# EAGLE design Select Fire Rapidstrike (EAGLE 9.4.2)

## Sheet 1 of 4
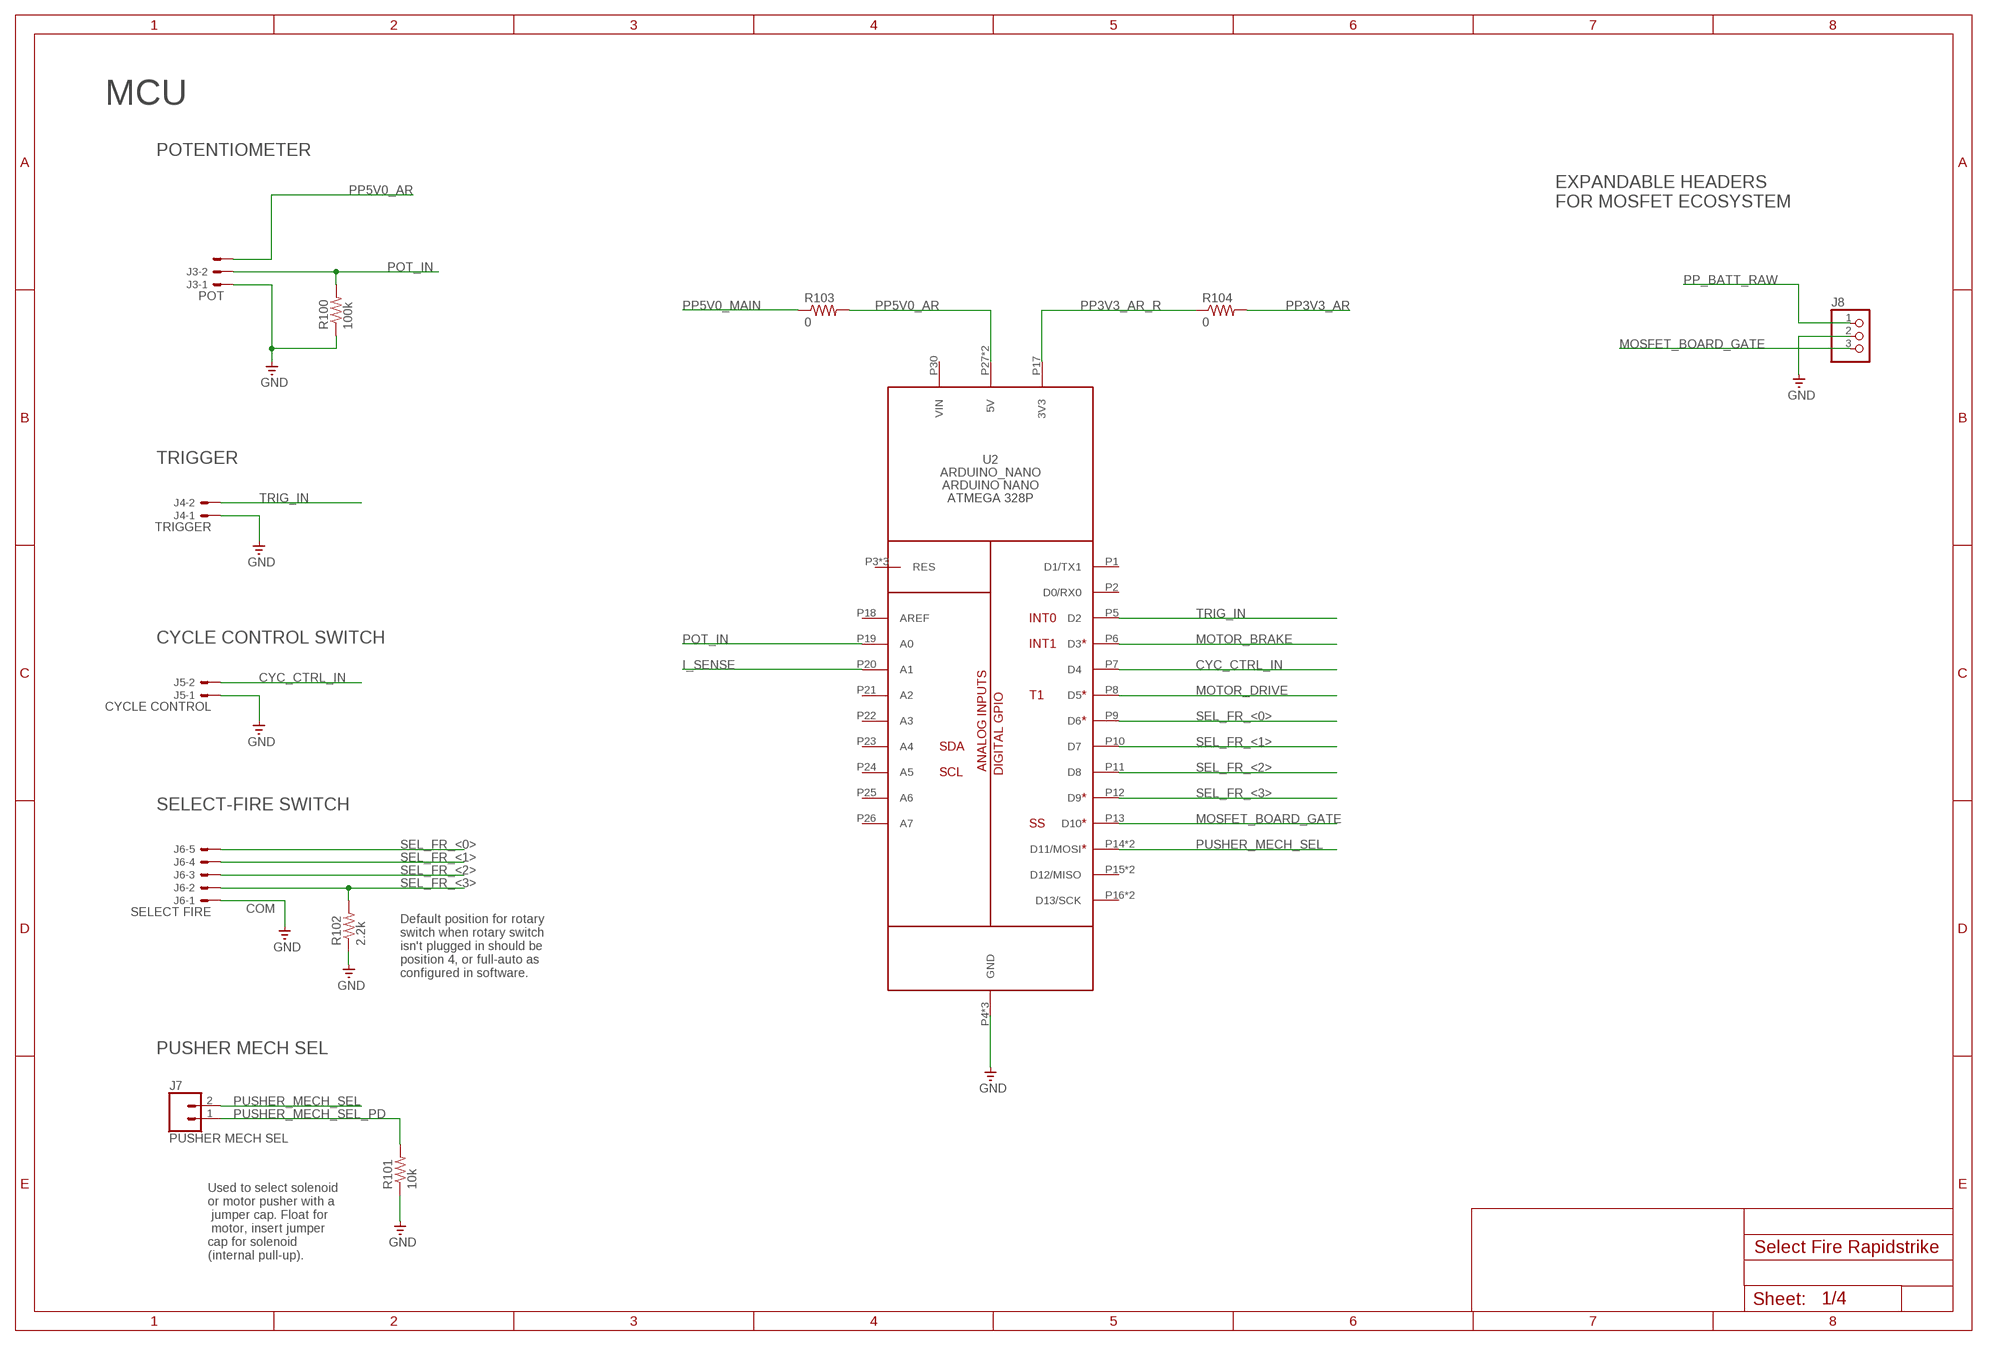
[diagram p0: schematic, sheet 1]

### Parts
J3  POT  JST-XH-03-PIN-LONG-PAD  [JST-XH-03-PACKAGE-LONG-PAD]
J4  TRIGGER  JST-XH-02-PIN-LONG-PAD  [JST-XH-02-PACKAGE-LONG-PAD]
J5  CYCLE CONTROL  JST-XH-02-PIN-LONG-PAD  [JST-XH-02-PACKAGE-LONG-PAD]
J6  SELECT FIRE  JST-XH-05-PIN-LONG-PAD  [JST-XH-05-PACKAGE-LONG-PAD]
J7  PUSHER MECH SEL  CONN_02  [1X02]
J8  PINHD-1X3  [1X03]
R100  100k  R-US_M0805  [M0805]
R101  10k  R-US_M0805  [M0805]
R102  2.2k  R-US_M0805  [M0805]
R103  0  R-US_M0805  [M0805]
R104  0  R-US_M0805  [M0805]
U2  ARDUINO_NANO  [ARDUINO_NANO]

### Nets
CYC_CTRL_IN: J5.2 U2.P7(D4)
GND: J3.1 J4.1 J5.1 J6.1 J8.2 R100.1 R101.1 R102.1 U2.P4(GND) U2.P29(GND) U2.P32(GND) ; also sheet 2,3,4
I_SENSE: U2.P20(A1) ; also sheet 3
MOSFET_BOARD_GATE: J8.3 U2.P13(D10)
MOTOR_BRAKE: U2.P6(D3) ; also sheet 3
MOTOR_DRIVE: U2.P8(D5) ; also sheet 3,4
POT_IN: J3.2 R100.2 U2.P19(A0)
PP3V3_AR: R104.2 ; also sheet 2
PP3V3_AR_R: R104.1 U2.P17(3V3)
PP5V0_AR: J3.3 R103.2 U2.P27(5V) U2.P36(5V) ; also sheet 2,3,4
PP5V0_MAIN: R103.1 ; also sheet 2
PP_BATT_RAW: J8.1 ; also sheet 2,3
PUSHER_MECH_SEL: J7.2 U2.P14(D11/MOSI) U2.P34(D11/MOSI)
PUSHER_MECH_SEL_PD: J7.1 R101.2
SEL_FR_<0>: J6.5 U2.P9(D6)
SEL_FR_<1>: J6.4 U2.P10(D7)
SEL_FR_<2>: J6.3 U2.P11(D8)
SEL_FR_<3>: J6.2 R102.2 U2.P12(D9)
TRIG_IN: J4.2 U2.P5(D2)
Unconnected: U2.P1(D1/TX1) U2.P2(D0/RX0) U2.P3(RES) U2.P15(D12/MISO) U2.P16(D13/SCK) U2.P18(AREF) U2.P21(A2) U2.P22(A3) U2.P23(A4) U2.P24(A5) U2.P25(A6) U2.P26(A7) U2.P28(RES) U2.P30(VIN) U2.P31(RES) U2.P33(D13/SCK) U2.P35(D12/MISO)

### Notes on the sheet
- MCU
- POTENTIOMETER
- EXPANDABLE HEADERS 
  FOR MOSFET ECOSYSTEM
- TRIGGER
- CYCLE CONTROL SWITCH
- SELECT-FIRE SWITCH
- COM
- Default position for rotary
  switch when rotary switch 
  isn't plugged in should be 
  position 4, or full-auto as 
  configured in software.
- PUSHER MECH SEL
- Used to select solenoid 
  or motor pusher with a
   jumper cap. Float for
   motor, insert jumper 
  cap for solenoid 
  (internal pull-up).

## Sheet 2 of 4
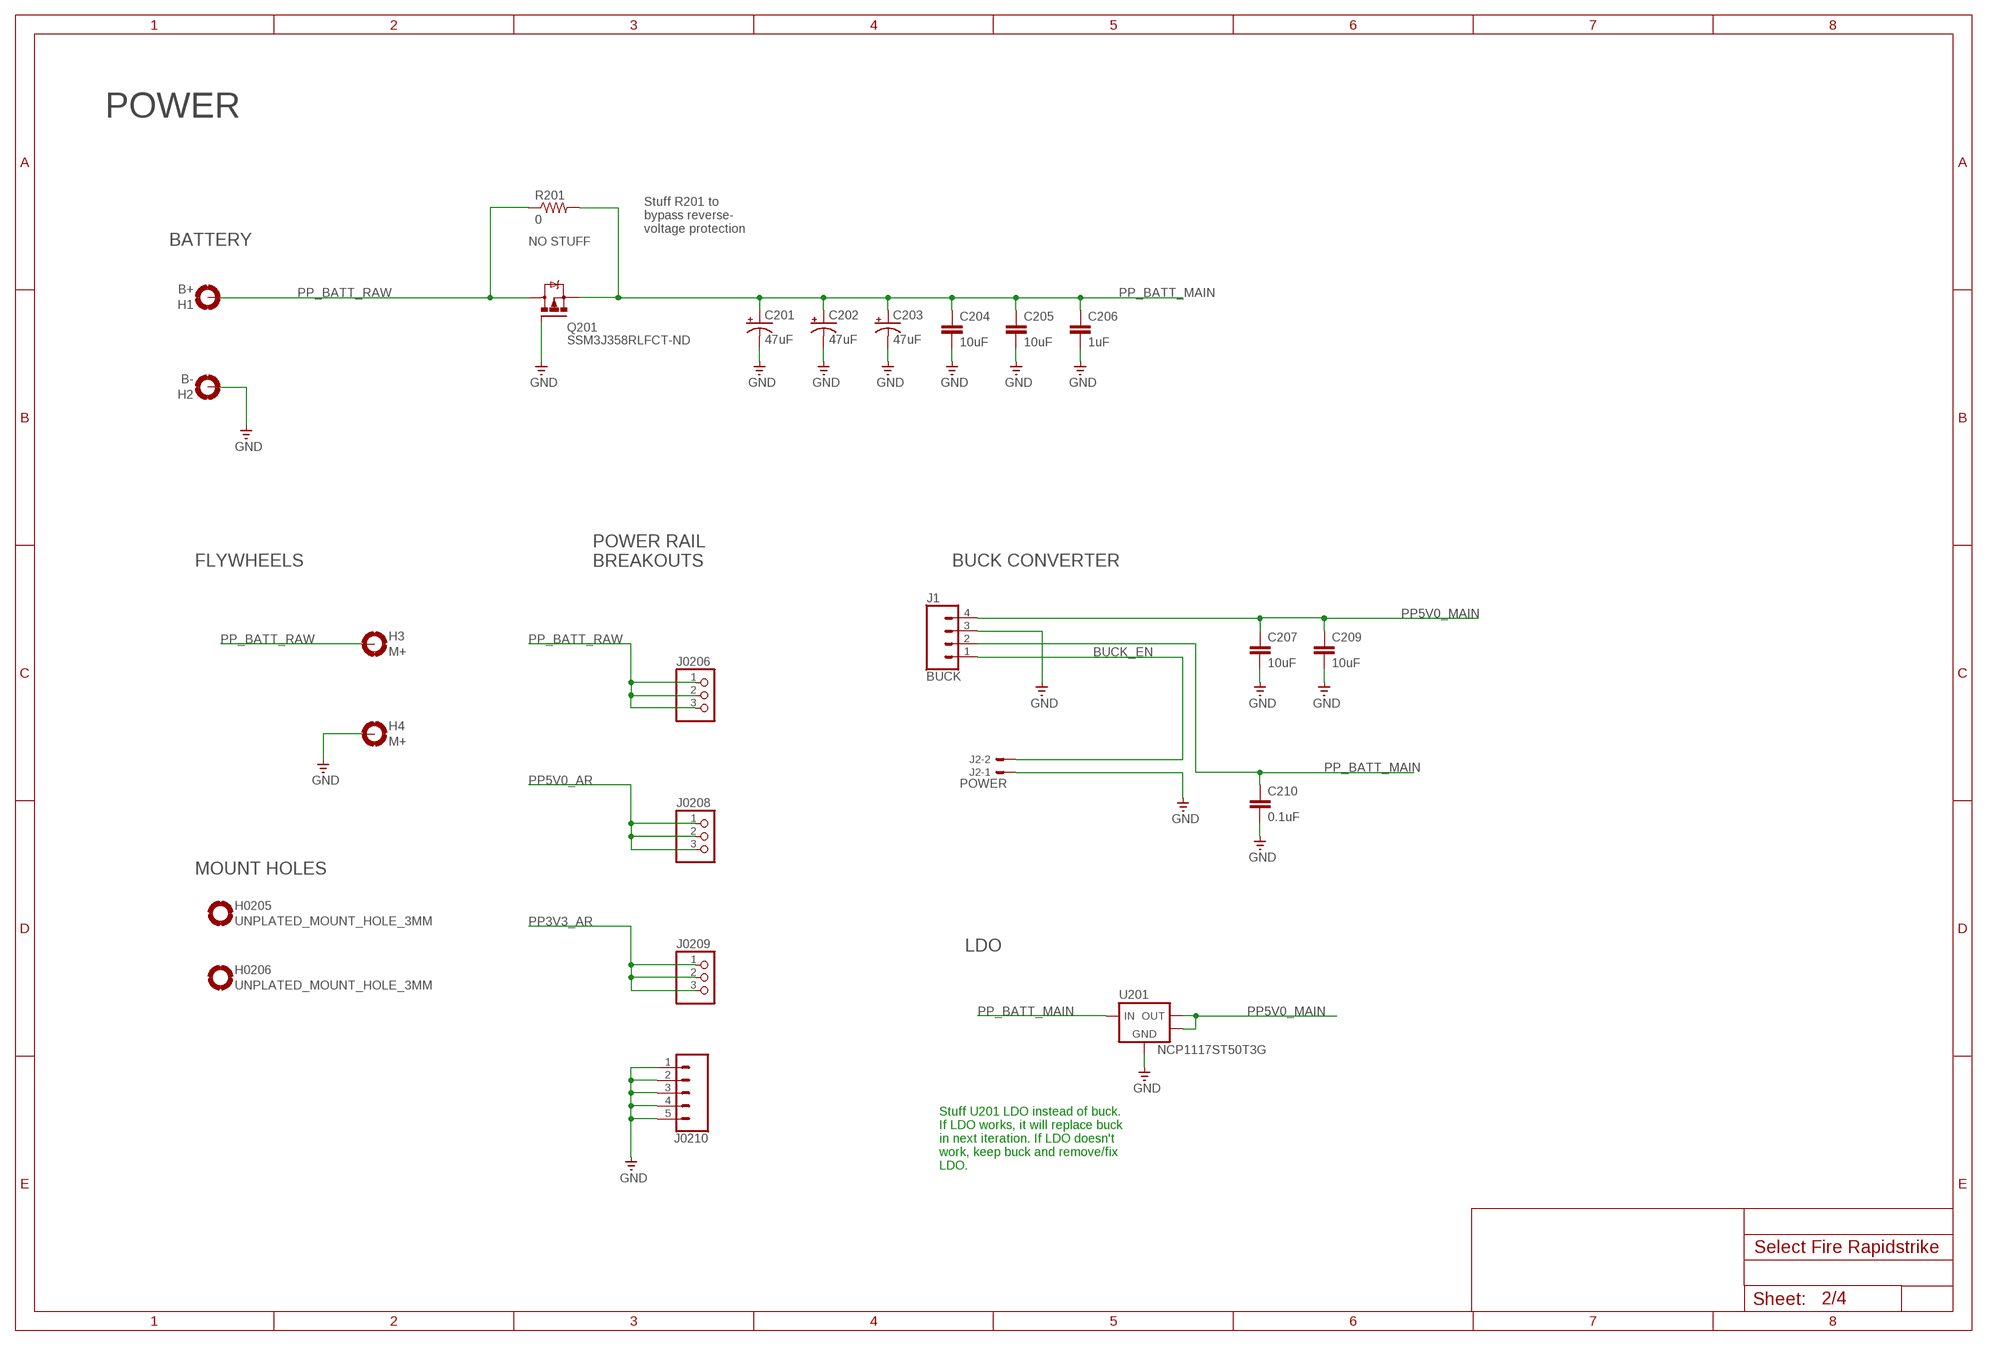
[diagram p1: schematic, sheet 2]

### Parts
C201  47uF  CPOL-USE2-5  [E2-5]
C202  47uF  CPOL-USE2-5  [E2-5]
C203  47uF  CPOL-USE2-5  [E2-5]
C204  10uF  CC1206  [C1206]
C205  10uF  CC1206  [C1206]
C206  1uF  C-EUC0805  [C0805]
C207  10uF  CC1206  [C1206]
C209  10uF  CC1206  [C1206]
C210  0.1uF  C-EUC0805  [C0805]
H1  B+  MOUNT-HOLE-2.5MM  [MOUNT-HOLE-2.5MM]
H2  B-  MOUNT-HOLE-2.5MM  [MOUNT-HOLE-2.5MM]
H3  M+  MOUNT-HOLE-2.5MM  [MOUNT-HOLE-2.5MM]
H4  M+  MOUNT-HOLE-2.5MM  [MOUNT-HOLE-2.5MM]
H0205  UNPLATED_MOUNT_HOLE_3MM  [UNPLATED_MOUNT_HOLE_3MM]
H0206  UNPLATED_MOUNT_HOLE_3MM  [UNPLATED_MOUNT_HOLE_3MM]
J1  BUCK  CONN_04  [1X04]
J2  POWER  JST-XH-02-PIN-LONG-PAD  [JST-XH-02-PACKAGE-LONG-PAD]
J0206  PINHD-1X3  [1X03]
J0208  PINHD-1X3  [1X03]
J0209  PINHD-1X3  [1X03]
J0210  CONN_05  [1X05]
Q201  SSM3J358RLFCT-ND  MOSFET-P-SOT23  [SOT-23]
R201  0  R-US_M0805  [M0805]
U201  NCP1117ST50T3G  LM1117-SOT223  [SOT-223-3]

### Nets
BUCK_EN: J1.1 J2.2
GND: C201.- C202.- C203.- C204.2 C205.2 C206.2 C207.2 C209.2 C210.2 H2.P$1(MOUNT) H4.P$1(MOUNT) J1.3 J2.1 J0210.1 J0210.2 J0210.3 J0210.4 J0210.5 Q201.1(G) U201.1(GND) ; also sheet 1,3,4
PP3V3_AR: J0209.1 J0209.2 J0209.3 ; also sheet 1
PP5V0_AR: J0208.1 J0208.2 J0208.3 ; also sheet 1,3,4
PP5V0_MAIN: C207.1 C209.1 J1.4 U201.2(VOUT) U201.4(HEATSINK) ; also sheet 1
PP_BATT_MAIN [BATT_POWER]: C201.+ C202.+ C203.+ C204.1 C205.1 C206.1 C210.1 J1.2 Q201.2(S) R201.2 U201.3(VIN)
PP_BATT_RAW: H1.P$1(MOUNT) H3.P$1(MOUNT) J0206.1 J0206.2 J0206.3 Q201.3(D) R201.1 ; also sheet 1,3

### Notes on the sheet
- POWER
- Stuff R201 to 
  bypass reverse-
  voltage protection
- BATTERY
- FLYWHEELS
- POWER RAIL
  BREAKOUTS
- BUCK CONVERTER
- MOUNT HOLES
- LDO
- Stuff U201 LDO instead of buck. 
  If LDO works, it will replace buck
  in next iteration. If LDO doesn't 
  work, keep buck and remove/fix
  LDO.

## Sheet 3 of 4
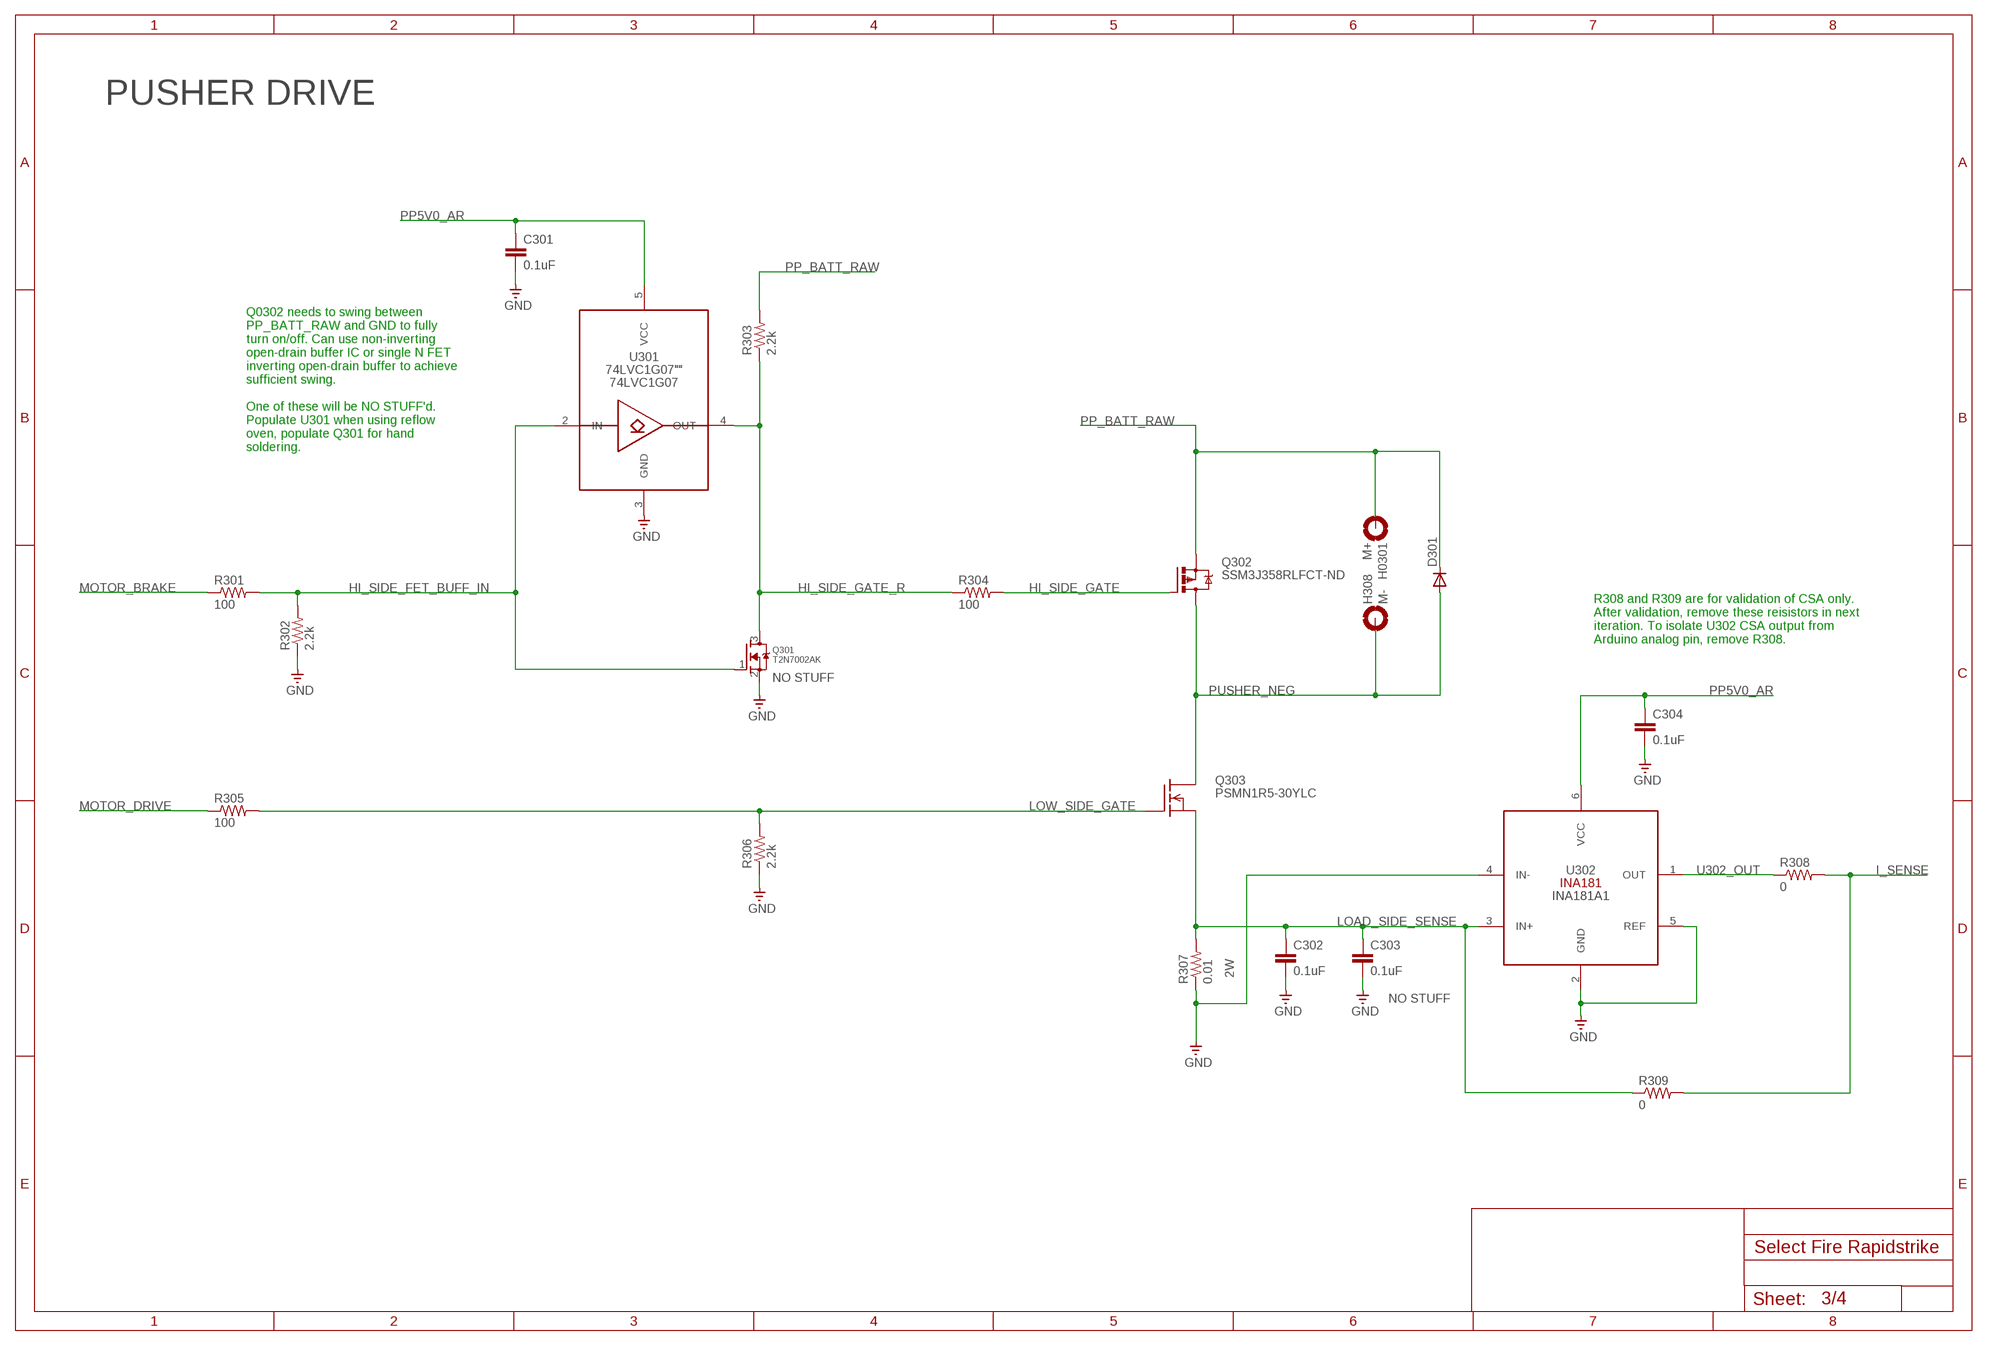
[diagram p2: schematic, sheet 3]

### Parts
C301  0.1uF  C-EUC0805  [C0805]
C302  0.1uF  C-EUC0805  [C0805]
C303  0.1uF  C-EUC0805  [C0805]
C304  0.1uF  C-EUC0805  [C0805]
D301  S2A  [DO214AA]
H0301  M+  MOUNT-HOLE-2.5MM  [MOUNT-HOLE-2.5MM]
H308  M-  MOUNT-HOLE-2.5MM  [MOUNT-HOLE-2.5MM]
Q301  T2N7002AK  MOSFET-NREFLOW  [SOT23]
Q302  SSM3J358RLFCT-ND  MOSFET-P-SOT23  [SOT-23]
Q303  PSMN1R5-30YLC  [TO127P600X120-5N]
R301  100  R-US_M0805  [M0805]
R302  2.2k  R-US_M0805  [M0805]
R303  2.2k  R-US_M0805  [M0805]
R304  100  R-US_M0805  [M0805]
R305  100  R-US_M0805  [M0805]
R306  2.2k  R-US_M0805  [M0805]
R307  0.01  R-US_R2512  [R2512]
R308  0  R-US_M0805  [M0805]
R309  0  R-US_M0805  [M0805]
U301  74LVC1G07""  [SOT353]
U302  INA181A1  INA181  [SOT23-6]

### Nets
GND: C301.2 C302.2 C303.2 C304.2 Q301.2(S) R302.1 R306.1 R307.1 U301.3(GND) U302.2(GND) U302.4(IN-) U302.5(REF) ; also sheet 1,2,4
HI_SIDE_FET_BUFF_IN: Q301.1(G) R301.2 R302.2 U301.2(IN)
HI_SIDE_GATE: Q302.1(G) R304.2 ; also sheet 4
HI_SIDE_GATE_R: Q301.3(D) R303.1 R304.1 U301.4(OUT)
I_SENSE: R308.2 R309.2 ; also sheet 1
LOAD_SIDE_SENSE: C302.1 C303.1 Q303.1(S) Q303.2(S) Q303.3(S) R307.2 R309.1 U302.3(IN+)
LOW_SIDE_GATE: Q303.4(G) R305.2 R306.2
MOTOR_BRAKE: R301.1 ; also sheet 1
MOTOR_DRIVE: R305.1 ; also sheet 1,4
PP5V0_AR: C301.1 C304.1 U301.5(VCC) U302.6(VCC) ; also sheet 1,2,4
PP_BATT_RAW: D301.C H0301.P$1(MOUNT) Q302.2(S) R303.2 ; also sheet 1,2
PUSHER_NEG: D301.A H308.P$1(MOUNT) Q302.3(D) Q303.5(D)
U302_OUT [BATT_POWER]: R308.1 U302.1(OUT)

### Notes on the sheet
- PUSHER DRIVE
- Q0302 needs to swing between 
  PP_BATT_RAW and GND to fully
  turn on/off. Can use non-inverting
  open-drain buffer IC or single N FET
  inverting open-drain buffer to achieve
  sufficient swing. 
  
  One of these will be NO STUFF'd. 
  Populate U301 when using reflow 
  oven, populate Q301 for hand 
  soldering.
- R308 and R309 are for validation of CSA only.
  After validation, remove these reisistors in next
  iteration. To isolate U302 CSA output from 
  Arduino analog pin, remove R308.

## Sheet 4 of 4
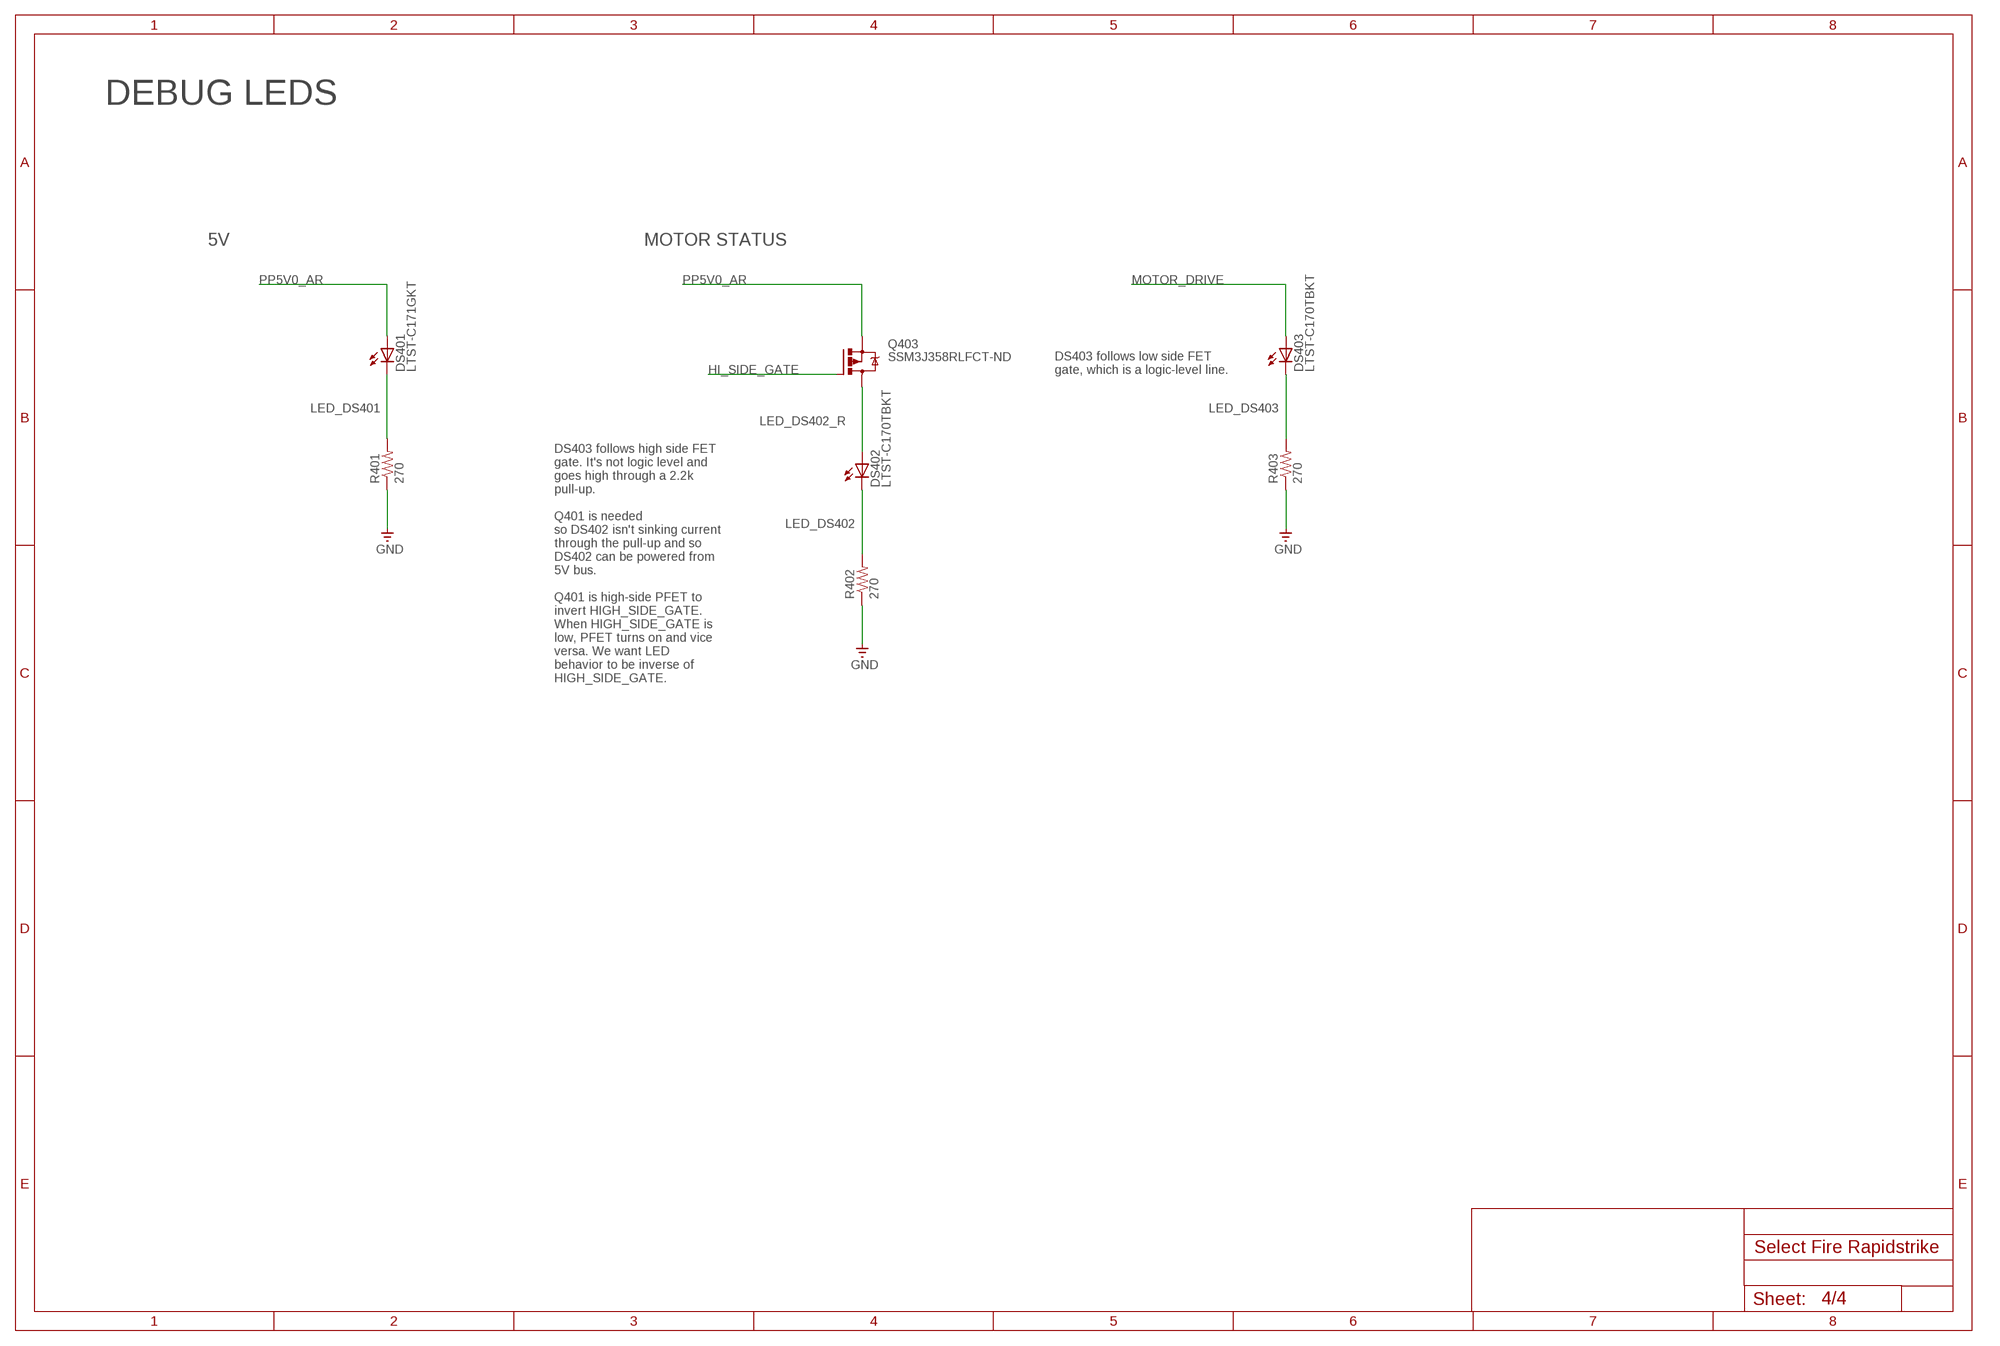
[diagram p3: schematic, sheet 4]

### Parts
DS401  LTST-C171GKT  LEDCHIPLED_0805  [CHIPLED_0805]
DS402  LTST-C170TBKT  LEDCHIPLED_0805  [CHIPLED_0805]
DS403  LTST-C170TBKT  LEDCHIPLED_0805  [CHIPLED_0805]
Q403  SSM3J358RLFCT-ND  MOSFET-P-SOT23  [SOT-23]
R401  270  R-US_M0805  [M0805]
R402  270  R-US_M0805  [M0805]
R403  270  R-US_M0805  [M0805]

### Nets
GND: R401.1 R402.1 R403.1 ; also sheet 1,2,3
HI_SIDE_GATE: Q403.1(G) ; also sheet 3
LED_DS401 [BATT_POWER]: DS401.C R401.2
LED_DS402 [BATT_POWER]: DS402.C R402.2
LED_DS402_R [BATT_POWER]: DS402.A Q403.3(D)
LED_DS403 [BATT_POWER]: DS403.C R403.2
MOTOR_DRIVE: DS403.A ; also sheet 1,3
PP5V0_AR: DS401.A Q403.2(S) ; also sheet 1,2,3

### Notes on the sheet
- DEBUG LEDS
- 5V | MOTOR STATUS
- DS403 follows low side FET 
  gate, which is a logic-level line.
- DS403 follows high side FET
  gate. It's not logic level and 
  goes high through a 2.2k 
  pull-up. 
  
  Q401 is needed 
  so DS402 isn't sinking current
  through the pull-up and so
  DS402 can be powered from 
  5V bus. 
  
  Q401 is high-side PFET to 
  invert HIGH_SIDE_GATE. 
  When HIGH_SIDE_GATE is 
  low, PFET turns on and vice
  versa. We want LED 
  behavior to be inverse of 
  HIGH_SIDE_GATE.

## Library data of the parts
C201-C203 = adafruit:CPOL-US: POLARIZED CAPACITOR, American symbol
C204 C205 C207 C209 = eagle-ltspice:C: CAPACITOR, European symbol; SPICEMODEL: NONE; SPICEPREFIX: C
C206 C210 C301 C302 C304 = rcl:C-EU: CAPACITOR, European symbol; SPICEPREFIX: C
C303 = rcl:C-EU: CAPACITOR, European symbol; SPICEPREFIX: C; STUFF: NO STUFF
D301 = s2x_10:S2*: S2A - S2M General Purpose Rectifiers Source: http://www.fairchildsemi.com/datasheets/S2/S2A.pdf; MF: Fairchild; MPN: S2A; OC_FARNELL: 1467485; OC_NEWARK: 58K2391
DS401-DS403 = adafruit:LED: LED OSRAM: - CHIPLED LG R971, LG N971, LY N971, LG Q971, LY Q971, LO R971, LY R971 LH N974, LH R974 LS Q976, LO Q976, LY Q976 LO Q996 - Hyper CHIPLED LW Q18S LB Q993, LB Q99A, LB R99A - SideLED LS A670, LO A670, LY A670, LG A670, LP A670 LB A673, LV A673, LT A673, LW A673 LH A674 LY A675 LS A676, LA A676, LO A676, LY A676, LW A676 LS A679, LY A679, LG A679 - Hyper Micro SIDELED® LS Y876, LA Y876, LO Y876, LY Y876 LT Y87S - SmartLED LW L88C, LW L88S LB L89C, LB L89S, LG L890 LS L89K, LO L89K, LY L89K LS L896, LA L896, LO L896, LY L896 - TOPLED LS T670, LO T670, LY T670, LG T670, LP T670 LSG T670, LSP T670, LSY T670, LOP T670, LYG T670 LG T671, LOG T671, LSG T671 LB T673, LV T673, LT T673, LW T673 LH T674 LS T676, LA T676, LO T676, LY T676, LB T676, LH T676, LSB T676, LW T676 LB T67C, LV T67C, LT T67C, LS T67K, LO T67K, LY T67K, LW E67C LS E67B, LA E67B, LO E67B, LY E67B, LB E67C, LV E67C, LT E67C LW T67C LS T679, LY T679, LG T679 LS T770, LO T770, LY T770, LG T770, LP T770 LB T773, LV T773, LT T773, LW T773 LH T774 LS E675, LA E675, LY E675, LS T675 LS T776, LA T776, LO T776, LY T776, LB T776 LHGB T686 LT T68C, LB T68C - Hyper Mini TOPLED® LB M676 - Mini TOPLED Santana® LG M470 LS M47K, LO M47K, LY M47K Source: http://www.osram.convergy.de/
H1-H4 H0301 H308 = my-eagle-lib:MOUNT-HOLE-2.5MM: Mount hole, 2.5mm inner diameter. Fits 14awg wiring great, 16awg a bit tight. Used in MOSFET board kit v1.2.
H0205 H0206 = my-eagle-lib:UNPLATED_MOUNT_HOLE_3MM: Unplated mount hole for Nerf Screws with 3mm (118.11 mill) diameter. Good if used near components that will be hand soldered so solder can't get on hole's copper plating
J1 = SparkFun-Connectors:CONN_04: Multi connection point. Often used as Generic Header-pin footprint for 0.1 inch spaced/style header connections On any of the 0.1 inch spaced packages, you can populate with these: Break Away Headers - Straight <https://www.sparkfun.com/products/116> (PRT-00116) Break Away Male Headers - Right Angle <https://www.sparkfun.com/products/553> (PRT-00553) Female Headers <https://www.sparkfun.com/products/115> (PRT-00115) Break Away Headers - Machine Pin <https://www.sparkfun.com/products/117> (PRT-00117) Break Away Female Headers - Swiss Machine Pin <https://www.sparkfun.com/products/743> (PRT-00743) For SCREWTERMINALS and SPRING TERMINALS visit here: Screw Terimnals on SparkFun.com <https://www.sparkfun.com/search/results?term=Screw+Terminals> (5mm/3.5mm/2.54mm spacing) This device is also useful as a general connection point to wire up your design to another part of your project. Our various solder wires solder well into these plated through hole pads. Hook-Up Wire - Assortment (Stranded, 22 AWG) <https://www.sparkfun.com/products/11375> (PRT-11375) Hook-Up Wire - Assortment (Solid Core, 22 AWG) <https://www.sparkfun.com/products/11367> (PRT-11367) View the entire wire category on our website here <https://www.sparkfun.com/categories/141> Special notes: Molex polarized connector foot print use with SKU : PRT-08231 with associated crimp pins and housings. 1MM SMD Version SKU: PRT-10208; PROD_ID: CONN-09696
J2 J4 J5 = Rembrandt Electronics - JST XH Connectors v1-0:JST-XH-02-PIN: JST XH Connector 2 Pin Wire to board connector. Pitch: 2,54 mm, (0.100") Number of pins: 2 Created by Rembrandt Electronics www.rembrandtelectronics.com
J3 = Rembrandt Electronics - JST XH Connectors v1-0:JST-XH-03-PIN: JST XH Connector 2 Pin Wire to board connector. Pitch: 2,54 mm, (0.100") Number of pins: 3 Created by Rembrandt Electronics www.rembrandtelectronics.com
J6 = Rembrandt Electronics - JST XH Connectors v1-0:JST-XH-05-PIN: JST XH Connector 2 Pin Wire to board connector. Pitch: 2,54 mm, (0.100") Number of pins: 5 Created by Rembrandt Electronics www.rembrandtelectronics.com
J7 = SparkFun-Connectors:CONN_02: Multi connection point. Often used as Generic Header-pin footprint for 0.1 inch spaced/style header connections On any of the 0.1 inch spaced packages, you can populate with these: Break Away Headers - Straight <https://www.sparkfun.com/products/116> (PRT-00116) Break Away Male Headers - Right Angle <https://www.sparkfun.com/products/553> (PRT-00553) Female Headers <https://www.sparkfun.com/products/115> (PRT-00115) Break Away Headers - Machine Pin <https://www.sparkfun.com/products/117> (PRT-00117) Break Away Female Headers - Swiss Machine Pin <https://www.sparkfun.com/products/743> (PRT-00743) For SCREWTERMINALS and SPRING TERMINALS visit here: Screw Terimnals on SparkFun.com <https://www.sparkfun.com/search/results?term=Screw+Terminals> (5mm/3.5mm/2.54mm spacing) This device is also useful as a general connection point to wire up your design to another part of your project. Our various solder wires solder well into these plated through hole pads. Hook-Up Wire - Assortment (Stranded, 22 AWG) <https://www.sparkfun.com/products/11375> (PRT-11375) Hook-Up Wire - Assortment (Solid Core, 22 AWG) <https://www.sparkfun.com/products/11367> (PRT-11367) View the entire wire category on our website here <https://www.sparkfun.com/categories/141> Special notes: Molex polarized connector foot print use with: PRT-08233 with associated crimp pins and housings. 2.54_SCREWTERM for use with PRT-10571. 3.5mm Screw Terminal footprints for PRT-08084 5mm Screw Terminal footprints for use with PRT-08432
J8 J0206 J0208 J0209 = adafruit:PINHD-1X3: PIN HEADER
J0210 = SparkFun-Connectors:CONN_05: Multi connection point. Often used as Generic Header-pin footprint for 0.1 inch spaced/style header connections On any of the 0.1 inch spaced packages, you can populate with these: Break Away Headers - Straight <https://www.sparkfun.com/products/116> (PRT-00116) Break Away Male Headers - Right Angle <https://www.sparkfun.com/products/553> (PRT-00553) Female Headers <https://www.sparkfun.com/products/115> (PRT-00115) Break Away Headers - Machine Pin <https://www.sparkfun.com/products/117> (PRT-00117) Break Away Female Headers - Swiss Machine Pin <https://www.sparkfun.com/products/743> (PRT-00743) For SCREWTERMINALS and SPRING TERMINALS visit here: Screw Terimnals on SparkFun.com <https://www.sparkfun.com/search/results?term=Screw+Terminals> (5mm/3.5mm/2.54mm spacing) This device is also useful as a general connection point to wire up your design to another part of your project. Our various solder wires solder well into these plated through hole pads. Hook-Up Wire - Assortment (Stranded, 22 AWG) <https://www.sparkfun.com/products/11375> (PRT-11375) Hook-Up Wire - Assortment (Solid Core, 22 AWG) <https://www.sparkfun.com/products/11367> (PRT-11367) View the entire wire category on our website here <https://www.sparkfun.com/categories/141> Special notes: Molex polarized connector foot print use with SKU : PRT-08231 with associated crimp pins and housings. 1MM SMD Version SKU: PRT-10208
Q201 Q302 Q403 = bt_transistor:MOSFET-P: P-Channel MOSFET with integrated body diode
Q301 = adafruit:MOSFET-N: N-Channel Mosfet 2N7002E - 60V 260mA SOT23 [Digikey: 2N7002ET1GOSTR-ND] - REEL BSH103 - 30V 850mA SOT23 [Digikey: 568-5013-1-ND]; STUFF: NO STUFF
Q303 = my-eagle-lib:PSMN1R5-30YLC: PSMN1R5-30YLC N-Channel Power MOSFET 30V, 100A, 1.55mΩ logic level MOSFET, surface-mount SOT669 package Datasheet <https://assets.nexperia.com/documents/data-sheet/PSMN1R5-30YLC.pdf> DigiKey Buy Link <https://www.digikey.com/product-detail/en/nexperia-usa-inc/PSMN1R5-30YLC115/1727-5297-1-ND/2674291> Package stolen from here <https://www.mikrocontroller.net/topic/236049> Symbol stolen from here <https://github.com/adafruit/Adafruit-Eagle-Library>
R100-R104 R301-R306 R308 R309 R401-R403 = adafruit:R-US_: RESISTOR, American symbol
R201 = adafruit:R-US_: RESISTOR, American symbol; STUFF: NO STUFF
R307 = adafruit:R-US_: RESISTOR, American symbol; POWER: 2W
U2 = my-eagle-lib:ARDUINO_NANO
U201 = bt_regulator:LM1117: LDO Voltage Regulator NCP1117 Output Current in Excess of 1.0 A 1.2 V Maximum Dropout Voltage at 800 mA Over Temperature Fixed Output Voltages of 1.5, 1.8, 1.9, 2.0, 2.5, 2.85, 3.3, 5.0, and 12 V Adjustable Output Voltage Option No Minimum Load Requirement for Fixed Voltage Output Devices Reference/Output Voltage Trimmed to ±1.0% Current Limit, Safe Operating and Thermal Shutdown Protection Operation to 20 V Input NCV Prefix for Automotive and Other Applications Requiring Unique Site and Control Change Requirements; AEC−Q100 Qualified and PPAP Capable datasheet.pdf <http://www.onsemi.com/pub/Collateral/NCP1117-D.PDF> LM1117 Available in 1.8 V, 2.5 V, 3.3 V, 5 V, and adjustable versions Output Current 800 mA Current Limiting and Thermal Protection Space-Saving SOT-223 and WSON Packages Line Regulation 0.2% (Maximum) Load Regulation 0.4% (Maximum) Temperature: LM1117: 0°C to 125°C; LM1117I: −40°C to 125°C LM1117 (Rev. N) is a series of low dropout voltage regulators of 1.2V at 800mA of load current. It has the same pin-out as Texas Instruments' industry standard LM317. The LM1117-N is available in an adjustable version, available in five fixed voltages, 1.8V, 2.5V, 2.85V, 3.3V, and 5V. The LM1117-N offers current limiting and thermal shutdown. Its circuit includes a zener trimmed to within ±1%. datasheet.pdf <http://www.ti.com/lit/ds/symlink/lm1117.pdf>
U301 = my-eagle-lib:74LVC1G07: The 74LVC1G07 is a single buffer gate with an open-drain output. The device is designed for operation with a power supply range of 1.65V to 5.5V. The input is tolerant to 5.5V allowing this device to be used in a mixed voltage environment. The device is fully specified for partial power down applications using IOFF. The IOFF circuitry disables the output preventing damaging current backflow when the device is powered down. The open-drain output can be connected to other open drain outputs to implement active-low wired-OR or active-high wired-AND functions. The maximum sink current is 32mA. https://www.diodes.com/assets/Datasheets/74LVC1G07.pdf
U302 = my-eagle-lib:INA181: The INA181, INA2181, and INA4181 (INAx181) current sense amplifiers are designed for costoptimized applications. These devices are part of a family of bidirectional, current-sense amplifiers (also called current-shunt monitors) that sense voltage drops across current-sense resistors at commonmode voltages from –0.2 V to +26 V, independent of the supply voltage. The INAx181 family integrates a matched resistor gain network in four, fixed-gain device options: 20 V/V, 50 V/V, 100 V/V, or 200 V/V. This matched gain resistor network minimizes gain error and reduces the temperature drift. These devices operate from a single 2.7-V to 5.5-V power supply. The single-channel INA181 draws a maximum supply current of 260 µA; whereas, the dual-channel INA2181 draws a maximum supply current of 500 µA, and the quad-channel INA4181 draws a maximum supply current of 900 µA. The INA181 is available in a 6-pin, SOT-23 package. The INA2181 is available in an 10-pin, VSSOP package. The INA4181 is available in a 20-pin, TSSOP package. All device options are specified over the extended operating temperature range of –40°C to +125°C. Footprint: SOT23-6 Datasheet: http://www.ti.com/lit/ds/symlink/ina181.pdf

## Net classes
1 BATT_POWER: width 0.254 mm

## Board
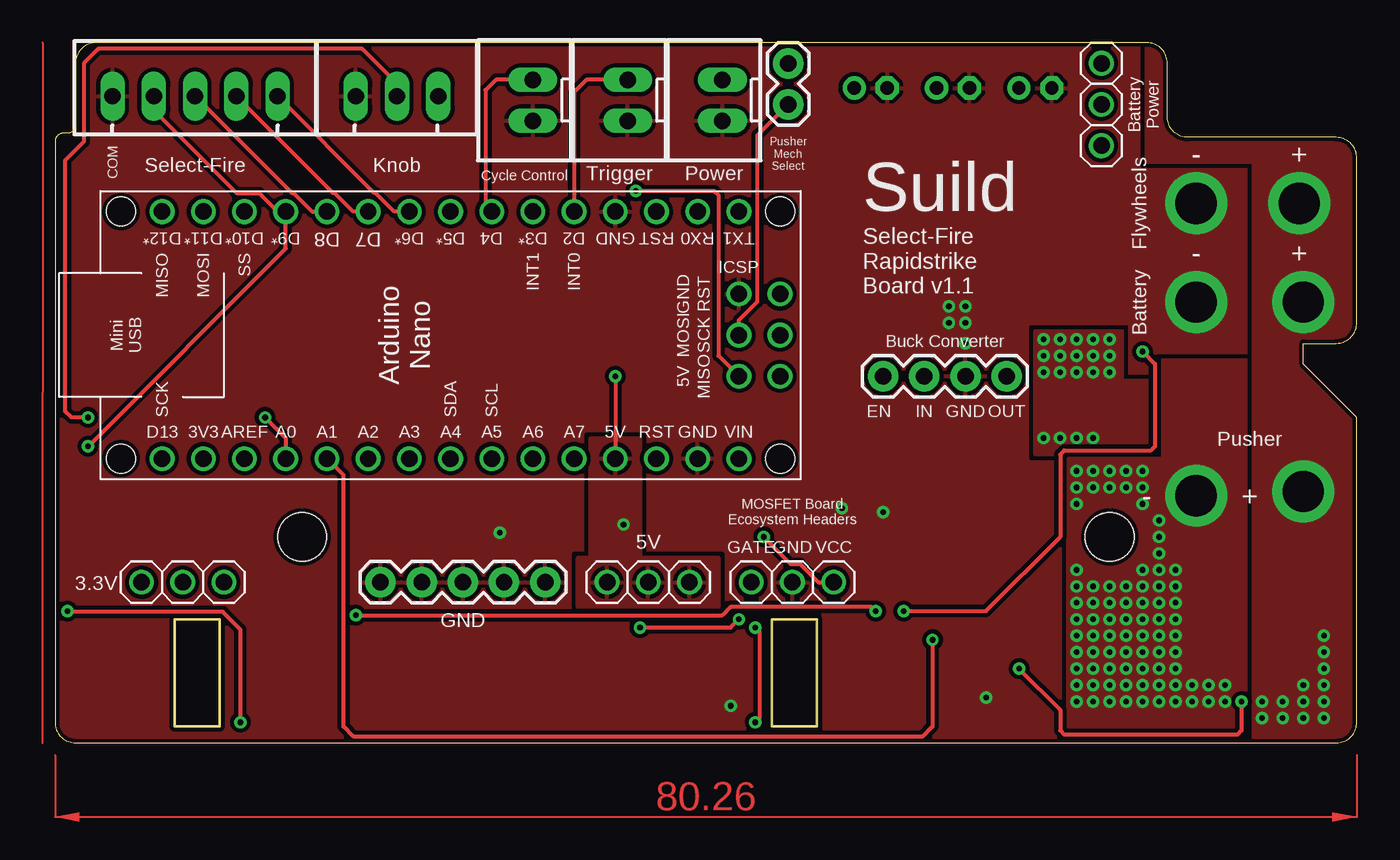
[diagram p4: board, top side]
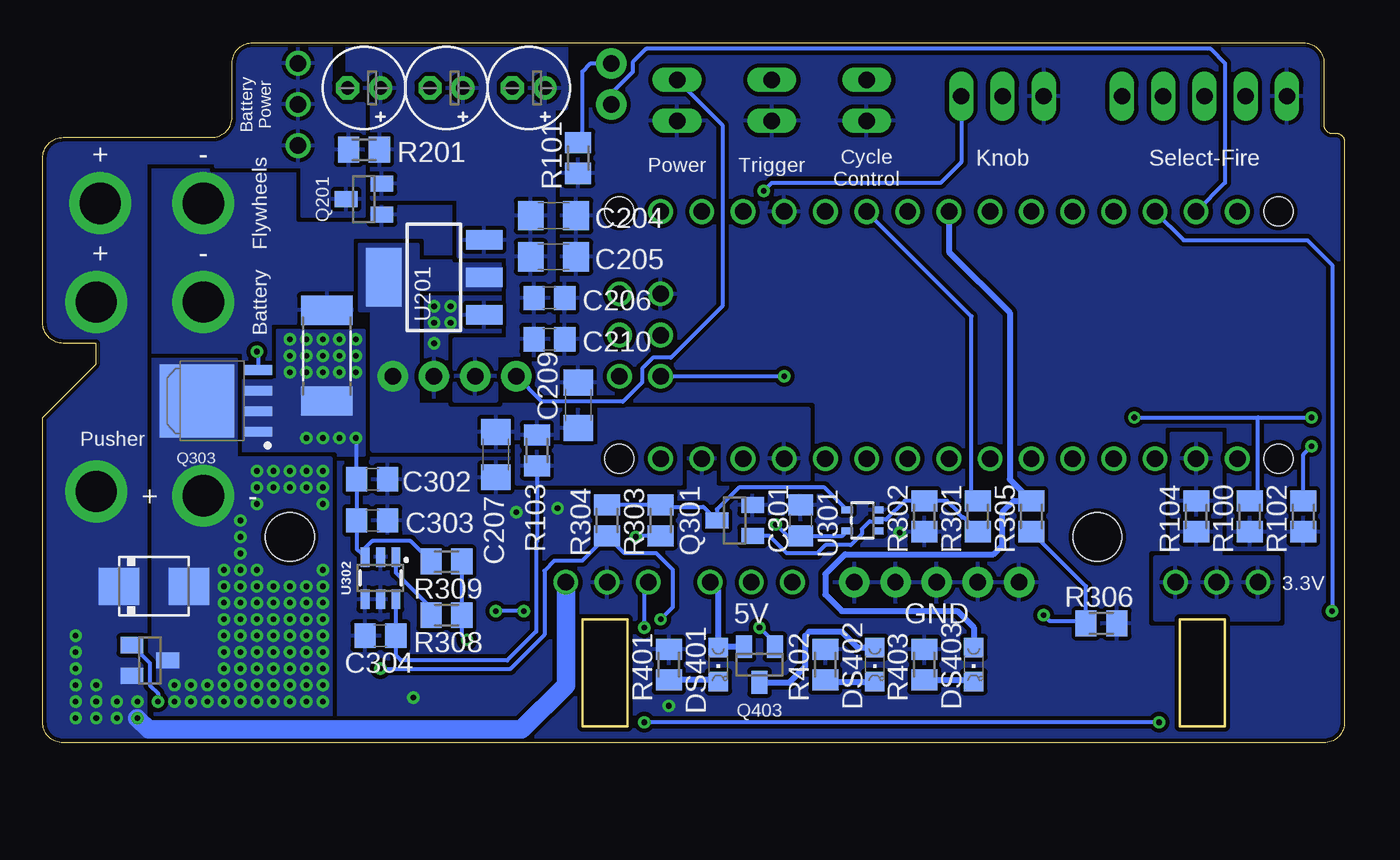
[diagram p5: board, bottom side, seen from below]

Size 80.26 x 43.18 mm. Coordinates in mm from the lower left corner, seen from the top.
Outline: 0.76,37.59 0.51,37.59 arc90 0,37.08 0,1.27 arc90 1.27,0 78.99,0 arc90 80.26,1.27 80.26,20.07 76.96,23.37 76.96,24.64 78.99,24.64 arc90 80.26,25.91 80.26,36.07 arc90 78.99,37.34 69.85,37.34 arc-90 68.58,38.61 68.58,41.91 arc90 67.31,43.18 2.54,43.18 arc90 1.27,41.91 1.27,38.1 arc-90 0.76,37.59
Outline: 7.37,7.62 10.16,7.62 10.16,1.02 7.37,1.02 7.37,7.62
Outline: 44.2,7.62 46.99,7.62 46.99,1.02 44.2,1.02 44.2,7.62
Copper layers (1*16): Top 0.035mm / dielectric 1.5mm / Bottom 0.035mm
Design rules "default *": minimum track width 10mil, minimum drill 0.35mm, track to track 10mil, track to pad 10mil, pad to pad 10mil, via to via 10mil, smd to smd 10mil, copper to edge 10mil, drill to drill 10mil, minimum pad ring 10mil, minimum via ring 8mil, stop-mask expansion 4mil, vias tented up to drill 30mil, thermal gap 10mil

### Footprints (pad centres in the part's own frame; a part is rotated, then mirrored left to right if it is on the bottom)
E2-5 = drill 0.813 pad 1.422: + -1.016,0 | drill 0.813 pad 1.422 octagon: - 1.016,0
C1206 = smd 1.6 x 1.8: 1 -1.4,0; 2 1.4,0
C0805 = smd 1.3 x 1.5: 1 -0.95,0; 2 0.95,0
DO214AA = smd 2.5 x 2.3: A 2.15,0; C -2.15,0
CHIPLED_0805 = smd 1.2 x 1.2: A 0,-1.05; C 0,1.05
MOUNT-HOLE-2.5MM = drill 2.54 pad 3.81: P$1 0,0
UNPLATED_MOUNT_HOLE_3MM = hole 3: 0,0
1X04 = drill 1.016 pad 1.88: 1 0,0; 2 2.54,0; 3 5.08,0; 4 7.62,0
JST-XH-02-PACKAGE-LONG-PAD = drill 1.016 long: 1 -1.27,0; 2 1.27,0
JST-XH-03-PACKAGE-LONG-PAD = drill 1.016 long: 1 -2.54,0; 2 0,0; 3 2.54,0
JST-XH-05-PACKAGE-LONG-PAD = drill 1.016 long: 1 -5.08,0; 2 -2.54,0; 3 0,0; 4 2.54,0; 5 5.08,0
1X02 = drill 1.016 pad 1.88: 1 0,0; 2 2.54,0
1X03 = drill 1.016: 1 -2.54,0; 2 0,0; 3 2.54,0
1X05 = drill 1.016 pad 1.88: 1 0,0; 2 2.54,0; 3 5.08,0; 4 7.62,0; 5 10.16,0
SOT-23 = smd 1 x 1.4: 1 -0.95,-1.1; 2 0.95,-1.1; 3 0,1.1
SOT23 = smd 1 x 1.4: 1 -0.95,-1.1; 2 0.95,-1.1; 3 0,1.1
TO127P600X120-5N = smd 1.65 x 0.6: 1 -2.65,1.905; 2 -2.65,0.635; 3 -2.65,-0.635; 4 -2.65,-1.905 | smd 4.6 x 4.5: 5 1.15,0
M0805 = smd 1.3 x 1.6: 1 -0.95,0; 2 0.95,0
R2512 = smd 1.8 x 3.2: 1 -2.8,0; 2 2.8,0
ARDUINO_NANO = drill 1.016: P1 -7.62,16.51; P2 -7.62,13.97; P3 -7.62,11.43; P4 -7.62,8.89; P5 -7.62,6.35; P6 -7.62,3.81; P7 -7.62,1.27; P8 -7.62,-1.27; P9 -7.62,-3.81; P10 -7.62,-6.35; P11 -7.62,-8.89; P12 -7.62,-11.43; P13 -7.62,-13.97; P14 -7.62,-16.51; P15 -7.62,-19.05; P16 7.62,-19.05; P17 7.62,-16.51; P18 7.62,-13.97; P19 7.62,-11.43; P20 7.62,-8.89; P21 7.62,-6.35; P22 7.62,-3.81; P23 7.62,-1.27; P24 7.62,1.27; P25 7.62,3.81; P26 7.62,6.35; P27 7.62,8.89; P28 7.62,11.43; P29 7.62,13.97; P30 7.62,16.51; P31 -2.54,19.05; P32 -2.54,16.51; P33 0,19.05; P34 0,16.51; P35 2.54,19.05; P36 2.54,16.51 | hole 1.778: -7.62,19.05; 7.62,19.05; -7.62,-21.59; 7.62,-21.59
SOT-223-3 = smd 1.219 x 2.235: 1 -2.311,-3.099; 2 0,-3.099; 3 2.311,-3.099 | smd 3.6 x 2.2: 4 0,3.099
SOT353 = smd 0.42 x 0.7: 1 -0.65,-0.95; 2 0,-0.95; 3 0.65,-0.95; 4 0.65,0.95; 5 -0.65,0.95
SOT23-6 = smd 0.55 x 1.2: 1 0.95,1.3; 2 0,1.3; 3 -0.95,1.3; 4 -0.95,-1.3; 5 0,-1.3; 6 0.95,-1.3

### Placement (x,y rotation side)
C201  60.45,40.39 180 bottom
C202  55.37,40.39 180 bottom
C203  50.29,40.39 180 bottom
C204  48.77,32.51 0 bottom
C205  48.77,29.97 0 bottom
C206  49.02,27.43 0 bottom
C207  52.32,17.78 270 bottom
C209  47.24,20.83 90 bottom
C210  49.02,24.89 0 bottom
C301  33.53,13.72 90 bottom
C302  59.94,16.26 0 bottom
C303  59.94,13.72 0 bottom
C304  59.44,6.6 180 bottom
D301  73.41,9.65 0 bottom
DS401  38.61,4.83 180 bottom
DS402  28.96,4.83 180 bottom
DS403  22.86,4.83 180 bottom
H1  76.71,33.27 0 top
H2  70.36,27.18 0 top
H3  76.96,15.49 0 bottom
H4  70.36,33.27 0 top
H0205  65.02,12.7 0 top
H0206  15.24,12.7 0 top
H0301  76.96,27.18 0 top
H308  70.36,15.24 0 top
J1  51.05,22.61 0 top
J2  41.15,39.62 90 top
J3  21.08,39.88 0 top
J4  35.31,39.62 90 top
J5  29.46,39.62 90 top
J6  8.64,39.88 0 top
J7  45.21,41.91 270 top
J8  45.47,9.91 180 top
J0206  64.52,39.37 270 top
J0208  36.58,9.91 180 top
J0209  7.87,9.91 0 top
J0210  20.07,9.91 0 top
Q201  60.45,33.53 90 bottom
Q301  37.59,13.72 90 bottom
Q302  73.66,5.08 270 bottom
Q303  69.6,21.08 180 bottom
Q403  36.07,4.83 180 bottom
R100  5.84,13.97 90 bottom
R101  47.24,36.07 90 bottom
R102  2.54,13.97 90 bottom
R103  49.78,18.03 270 bottom
R104  9.14,13.97 270 bottom
R201  60.45,36.58 0 bottom
R301  22.61,13.97 270 bottom
R302  25.91,13.97 90 bottom
R303  42.16,13.72 270 bottom
R304  45.47,13.72 270 bottom
R305  19.3,13.97 270 bottom
R306  14.99,7.37 180 bottom
R307  62.74,23.88 270 bottom
R308  55.37,7.87 0 bottom
R309  55.37,11.18 0 bottom
R401  41.66,4.83 270 bottom
R402  32,4.83 270 bottom
R403  25.91,4.83 270 bottom
U2  25.65,25.15 270 top
U201  56.13,28.7 90 bottom
U301  29.72,13.72 90 bottom
U302  59.44,10.16 0 bottom

### Tracks (layer width: path | path; a pad name or v marks a point on that pad's centre or on a via)
BUCK_EN
  Bottom 0.254: J1.1 49.49,21.05 44.48,21.05 43.31,22.23 43.31,23.08 42.64,23.75 41.53,23.75 38.35,26.92 38.35,38.1 J2.2
CYC_CTRL_IN
  Top 0.254: J5.2 27.18,40.89 26.54,40.26 26.54,33.15 U2.P7
GND  (via drill 0.35)
  other vias: 51.05,14.22 48.51,14.48 57.4,2.79 55.12,26.92 56.13,26.92 55.12,25.91 56.13,25.91 56.13,24.64 27.43,12.95 41.66,2.29
  pour Top (rank 6): -3.56,-3.56 -3.56,48.26 87.88,48.26 87.88,-3.56
  pour Bottom (rank 6): -3.81,48.51 88.14,48.51 88.14,-3.81 -3.81,-3.81
  pour Bottom (rank 6, no thermals): 70.36,24.89 68.07,24.89 68.07,35.56 73.66,35.56 73.66,24.89
  pour Top (rank 6, no thermals): 68.07,24.89 73.66,24.89 73.66,35.56 68.07,35.56
HI_SIDE_FET_BUFF_IN
  Bottom 0.254: R301.2 23.48,13.89 23.56,13.89 23.79,14.11 23.79,14.2 24.51,14.92 R302.2 27.12,14.92 28.26,13.77 28.71,13.77 U301.2 28.83,13.66 29.28,13.66 29.75,13.18 29.75,12.88 30.44,12.19 32,12.19 32.51,11.68 34.38,11.68 35.47,12.77 Q301.1
HI_SIDE_GATE  (via drill 0.35)
  Top 0.254: v73.15,2.54 73.15,0.76 72.9,0.51 62.23,0.51 61.98,0.76 61.98,2.03 v59.44,4.57 | v36.07,7.11 41.66,7.11 v42.16,7.62
  Bottom 0.254: Q302.1 73.66,4.93 73.66,3.56 73.15,3.05 v73.15,2.54 | v59.44,4.57 51.42,4.57 49.33,6.66 49.33,10.62 48.7,11.24 46.99,11.24 R304.2 44.38,11.68 42.42,11.68 41.4,10.67 41.4,8.38 v42.16,7.62 | Q403.1 35.12,6.16 v36.07,7.11
HI_SIDE_GATE_R
  Bottom 0.254: U301.4 32.05,15.75 37.34,15.75 38.69,14.39 Q301.3 39.53,14.56 42.06,14.56 R303.1 R304.1
I_SENSE  (via drill 0.35)
  Top 0.254: U2.P20 17.78,16.51 17.78,1.02 18.42,0.38 53.47,0.38 54.1,1.02 v54.1,6.35
  Bottom 0.254: R309.2 R308.2 54.42,6.67 v54.1,6.35
LED_DS401
  Bottom 0.381: DS401.C 38.71,3.88 R401.2
LED_DS402
  Bottom 0.381: R402.2 31.9,3.78 DS402.C
LED_DS402_R
  Bottom 0.381: 28.57,5.88 DS402.A 30.03,5.88 31.02,6.87 32.99,6.87 33.25,6.61 33.25,4.71 34.23,3.73 Q403.3
LED_DS403
  Bottom 0.381: DS403.C 22.96,3.88 R403.2
LOAD_SIDE_SENSE  (via drill 0.35)
  Bottom 0.254: U302.3 60.53,11.6 | 60.53,11.6 60.89,11.97 C303.1 C302.1 60.89,18.73 v60.96,18.8 | R309.1 57.59,12.45 59.94,12.45 60.53,11.86 60.53,11.6
  other vias: 60.96,24.89 60.96,23.88 60.96,22.86 61.98,24.89 61.98,23.88 61.98,22.86 62.99,24.89 62.99,23.88 62.99,22.86 64.01,24.89 64.01,23.88 64.01,22.86 65.02,24.89 65.02,23.88 65.02,22.86 61.98,18.8 62.99,18.8 64.01,18.8
  pour Bottom (rank 3, no thermals): 60.45,25.4 65.79,25.4 65.79,22.35 68.07,22.35 68.07,17.78 60.45,17.78
  pour Top (rank 3, no thermals): 60.45,25.4 65.53,25.4 65.79,25.4 65.79,22.35 68.07,22.35 68.07,17.78 60.45,17.78
LOW_SIDE_GATE  (via drill 0.35)
  Top 0.254: v67.06,24.13 67.82,23.37 67.82,18.29 67.56,18.03 62.23,18.03 61.98,17.78 61.98,12.7 57.4,8.13 v52.32,8.13 | v50.59,8.13 50.34,8.38 41.66,8.38 41.15,7.87 v18.54,7.87
  Bottom 0.254: Q303.4 66.95,24.02 v67.06,24.13 | 16.44,7.87 16.1,7.53 | 16.1,7.53 R306.2 15.94,9.65 R305.2 | v50.59,8.13 v52.32,8.13 | v18.54,7.87 18.19,7.53 16.1,7.53
MOSFET_BOARD_GATE  (via drill 0.35)
  Top 0.254: v0.76,8.13 0.81,8.08 10.35,8.08 11.43,7 v11.43,1.27 | v43.18,1.27 43.43,1.52 43.43,6.86 v43.18,7.11
  Bottom 0.254: U2.P13 9.91,30.99 2.29,30.99 0.76,29.46 v0.76,8.13 | J8.3 43.18,9.65 v43.18,7.11 | v11.43,1.27 v43.18,1.27
MOTOR_BRAKE
  Bottom 0.254: U2.P6 22.99,26.29 22.99,15.3 R301.1
MOTOR_DRIVE
  Bottom 0.381: U2.P8 24.38,30.27 20.64,26.53 20.64,16.25 R305.1 20.39,14.92 21.08,14.22 21.08,12.19 21.65,11.62 30.8,11.62 32,10.41 32,9.14 30.99,8.13 23.88,8.13 22.86,7.11 DS403.A
POT_IN  (via drill 0.35)
  Top 0.254: J3.2 21.08,40.64 18.92,42.8 2.67,42.8 1.78,41.91 1.78,37.08 0.64,35.94 0.64,20.45 1.02,20.07 v2.03,20.07 | v12.95,20.07 14.22,18.8 U2.P19
  Bottom 0.254: v12.95,20.07 5.33,20.07 | 5.33,20.07 v2.03,20.07 | R100.2 5.33,15.43 5.33,20.07
PP3V3_AR
  pour Bottom (rank 2): 10.67,11.43 11.68,11.43 11.68,7.62 4.06,7.62 4.06,11.43 7.62,11.43 7.62,13.97 10.67,13.97
PP3V3_AR_R
  pour Bottom: 7.62,13.97 7.62,19.05 10.67,19.05 10.67,13.97
PP5V0_AR  (via drill 0.35)
  Top 0.254: v35.81,34.04 40.64,34.04 40.89,33.78 40.89,23.88 U2.P36 | v34.54,22.61 U2.P27
  Bottom 0.254: J3.3 23.62,35.81 24.89,34.54 35.31,34.54 v35.81,34.04 | U2.P36 v34.54,22.61 | U301.5 30.97,12.77 C301.1 34.36,12.77 v35.05,13.46 | U302.6 C304.1 58.49,5.4 58.17,5.08 51.63,5.08 49.84,6.87 49.84,12.35 49.78,12.4 R103.2
  Bottom 0.381: J0208.1 38.61,9.4 DS401.A 38.56,5.93 Q403.2
  pour Top (rank 2): 40.89,8.38 32.26,8.38 32.26,11.43 33.02,11.43 33.02,18.8 36.07,18.8 36.07,11.43 40.89,11.43
  pour Bottom (rank 3): 45.97,20.57 45.97,18.29 51.05,18.29 51.05,16 40.89,16 40.89,18.54 38.35,18.54 38.35,16.26 33.02,16.26 33.02,20.57
PP5V0_MAIN
  pour Bottom (rank 4, no thermals): 57.15,27.94 57.15,18.03 59.94,18.03 59.94,26.67 60.71,26.67 60.71,30.73 57.15,30.73 57.15,29.72 51.82,29.72 51.82,27.94
  pour Bottom (rank 4): 57.15,20.83 59.94,20.83 59.94,18.03 45.72,18.03 45.72,20.83
PP_BATT_MAIN
  pour Bottom (rank 2): 52.32,23.88 52.32,21.08 54.86,21.08 54.86,24.89 51.56,24.89 51.56,29.97 54.61,29.97 54.61,33.53 59.94,33.53 59.94,39.88 60.45,39.88 60.45,40.89 60.96,41.4 61.47,41.4 61.47,44.2 48.01,44.2 48.01,39.12 48.77,39.12 48.77,23.88
PP_BATT_RAW  (via drill 0.35)
  Top 0.254: v43.69,12.7 45.34,11.05 45.94,11.05 47.08,9.91 J8.1
  Bottom 0.254: R303.2 43.62,12.77 v43.69,12.7
  Bottom 1.143: v74.42,1.52 73.72,0.82 50.74,0.82 48.01,3.56 J8.1
  other vias: 78.23,6.6 78.23,5.59 78.23,4.57 78.23,3.56 78.23,2.54 78.23,1.52 76.96,3.56 76.96,2.54 76.96,1.52 75.69,2.54 75.69,1.52 74.42,2.54
  pour Bottom: 62.48,46.74 69.6,46.74 69.6,35.56 64.26,35.56 64.26,32.51 60.45,32.51 60.45,39.37 61.72,39.37 62.48,40.13
  pour Bottom (no thermals): 84.07,46.74 84.07,-2.79 73.91,-2.79 73.91,35.81 67.31,35.81 67.31,46.74
  pour Top (no thermals): 67.31,46.74 84.07,46.74 84.07,-2.79 73.91,-2.79 73.91,35.81 67.31,35.81
PUSHER_MECH_SEL
  Top 0.254: J7.2 43.31,37.47 43.31,27.21 42.16,26.07 U2.P34
  Bottom 0.254: U2.P14 7.37,34.54 7.37,41.91 8.25,42.8 43.05,42.8 43.89,41.96 43.89,41.36 45.21,40.04 J7.2
PUSHER_MECH_SEL_PD
  Bottom 0.254: R101.2 46.99,37.27 46.99,41.4 46.48,41.91 J7.1
PUSHER_NEG  (via drill 0.35)
  other vias: 68.07,9.65 67.06,16.76 68.07,12.7 67.06,14.73 67.06,15.75 68.07,10.67 67.06,9.65 67.06,10.67 66.04,9.65 68.07,11.68 64.01,16.76 62.99,16.76 62.99,15.75 64.01,15.75 66.04,15.75 66.04,16.76 65.02,16.76 65.02,15.75 68.07,13.72 67.06,8.64 68.07,7.62 68.07,8.64 67.06,7.62 66.04,8.64 66.04,7.62 68.07,6.6 68.07,5.59 66.04,5.59 66.04,6.6 67.06,6.6 67.06,5.59 65.02,9.65 64.01,9.65 62.99,9.65 64.01,8.64 65.02,7.62 65.02,8.64 64.01,7.62 62.99,8.64 62.99,7.62 65.02,6.6 65.02,5.59 62.99,5.59 62.99,6.6 64.01,6.6 64.01,5.59 68.07,4.57 66.04,4.57 67.06,4.57 65.02,4.57 62.99,4.57 64.01,4.57 69.09,7.62 69.09,5.59 69.09,6.6 69.09,4.57 69.09,9.65 69.09,10.67 69.09,8.64 62.99,10.67 62.99,14.73 70.1,3.56 70.1,2.54 71.12,3.56 71.12,2.54 68.07,3.56 66.04,3.56 67.06,3.56 65.02,3.56 62.99,3.56 64.01,3.56 68.07,2.54 66.04,2.54 67.06,2.54 65.02,2.54 62.99,2.54 64.01,2.54 69.09,3.56 69.09,2.54 72.14,3.56 72.14,2.54
  pour Bottom (rank 2, no thermals): 68.33,23.62 73.66,23.62 73.66,-2.54 62.48,-2.54 62.48,17.53 68.33,17.53
  pour Top (rank 2, no thermals): 68.33,23.62 73.66,23.62 73.66,-2.79 62.48,-2.79 62.48,17.53 68.33,17.53
SEL_FR_<0>
  Top 0.254: U2.P9 20.92,32.77 19.78,33.91 19.69,33.91 J6.5
SEL_FR_<1>
  Top 0.254: U2.P10 18.38,32.77 17.24,33.91 17.14,33.91 J6.4
SEL_FR_<2>
  Top 0.254: J6.3 14.61,33.91 14.7,33.91 15.84,32.77 U2.P11
SEL_FR_<3>  (via drill 0.35)
  Top 0.254: J6.2 6.1,39.02 11.21,33.91 12.57,33.91 13.72,32.77 U2.P12 14.22,30.48 v2.03,18.29
  Bottom 0.254: R102.2 2.54,17.78 v2.03,18.29
TRIG_IN
  Top 0.254: J4.2 32.77,40.89 32,40.13 U2.P5
U302_OUT
  Bottom 0.254: R308.1 56.32,8.32 58.49,10.48 U302.1
(copper drawn outside any net)
  shapes: Top area x2

### Text on the board
tNames: Battery / Power | Pusher / Mech / Select | COM | - | + | Select-Fire | Knob | Cycle Control | Trigger | Power | Flywheels | Suild | - | + | Select-Fire / Rapidstrike / Board v1.1 | Battery | Buck Converter | EN | IN | GND | OUT | Pusher | - | + | MOSFET Board / Ecosystem Headers | 5V | GATE | GND | VCC | 3.3V | GND
bNames: Battery / Power | Select-Fire | Knob | Cycle / Control | - | + | Trigger | Power | Flywheels | - | + | Battery | Pusher | - | + | 3.3V | GND | 5V